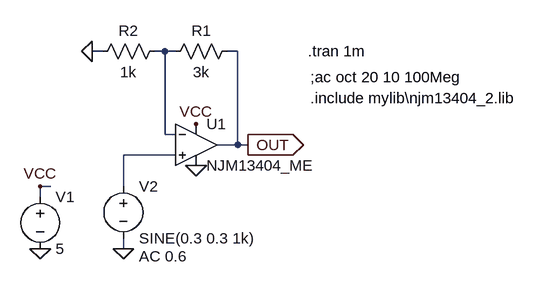
[diagram p0: schematic AD9833_Amp.asc]
AD9833_Amp.asc, the LTspice schematic file:
Version 4
SHEET 1 960 680
WIRE 256 -16 240 -16
WIRE 352 -16 336 -16
WIRE 368 -16 352 -16
WIRE 464 -16 448 -16
WIRE 352 112 352 -16
WIRE 368 112 352 112
WIRE 464 128 464 -16
WIRE 464 128 432 128
WIRE 480 128 464 128
WIRE 368 144 288 144
WIRE 176 192 160 192
WIRE 288 192 288 144
WIRE 160 208 160 192
WIRE 288 288 288 272
FLAG 160 288 0
FLAG 160 192 VCC
FLAG 288 288 0
FLAG 240 -16 0
FLAG 400 160 0
FLAG 400 96 VCC
FLAG 480 128 OUT
IOPIN 480 128 Out
SYMBOL voltage 160 192 R0
WINDOW 123 24 124 Left 2
WINDOW 39 0 0 Left 2
SYMATTR InstName V1
SYMATTR Value 5
SYMBOL voltage 288 176 R0
WINDOW 123 24 124 Left 2
WINDOW 39 0 0 Left 2
SYMATTR InstName V2
SYMATTR Value SINE(0.3 0.3 1k)
SYMATTR Value2 AC 0.6
SYMBOL res 464 -32 R90
WINDOW 0 0 56 VBottom 2
WINDOW 3 32 56 VTop 2
SYMATTR InstName R1
SYMATTR Value 3k
SYMBOL res 352 -32 R90
WINDOW 0 0 56 VBottom 2
WINDOW 3 32 56 VTop 2
SYMATTR InstName R2
SYMATTR Value 1k
SYMBOL Opamps\\opamp2 400 64 R0
SYMATTR InstName U1
SYMATTR Value NJM13404_ME
TEXT 572 -16 Left 2 !.tran 1m
TEXT 576 24 Left 2 !;ac oct 20 10 100Meg
TEXT 576 56 Left 2 !.include mylib\\njm13404_2.lib

The netlist it stands for:
* AD9833_Amp.asc
V1 VCC 0 5
V2 N002 0 SINE(0.3 0.3 1k) AC 0.6
R1 OUT N001 3k
R2 N001 0 1k
XU1 N002 N001 VCC 0 OUT NJM13404_ME  ; pins In+ In- V+ V- OUT
.tran 1m
;ac oct 20 10 100Meg
.include mylib\njm13404_2.lib
.backanno
.end